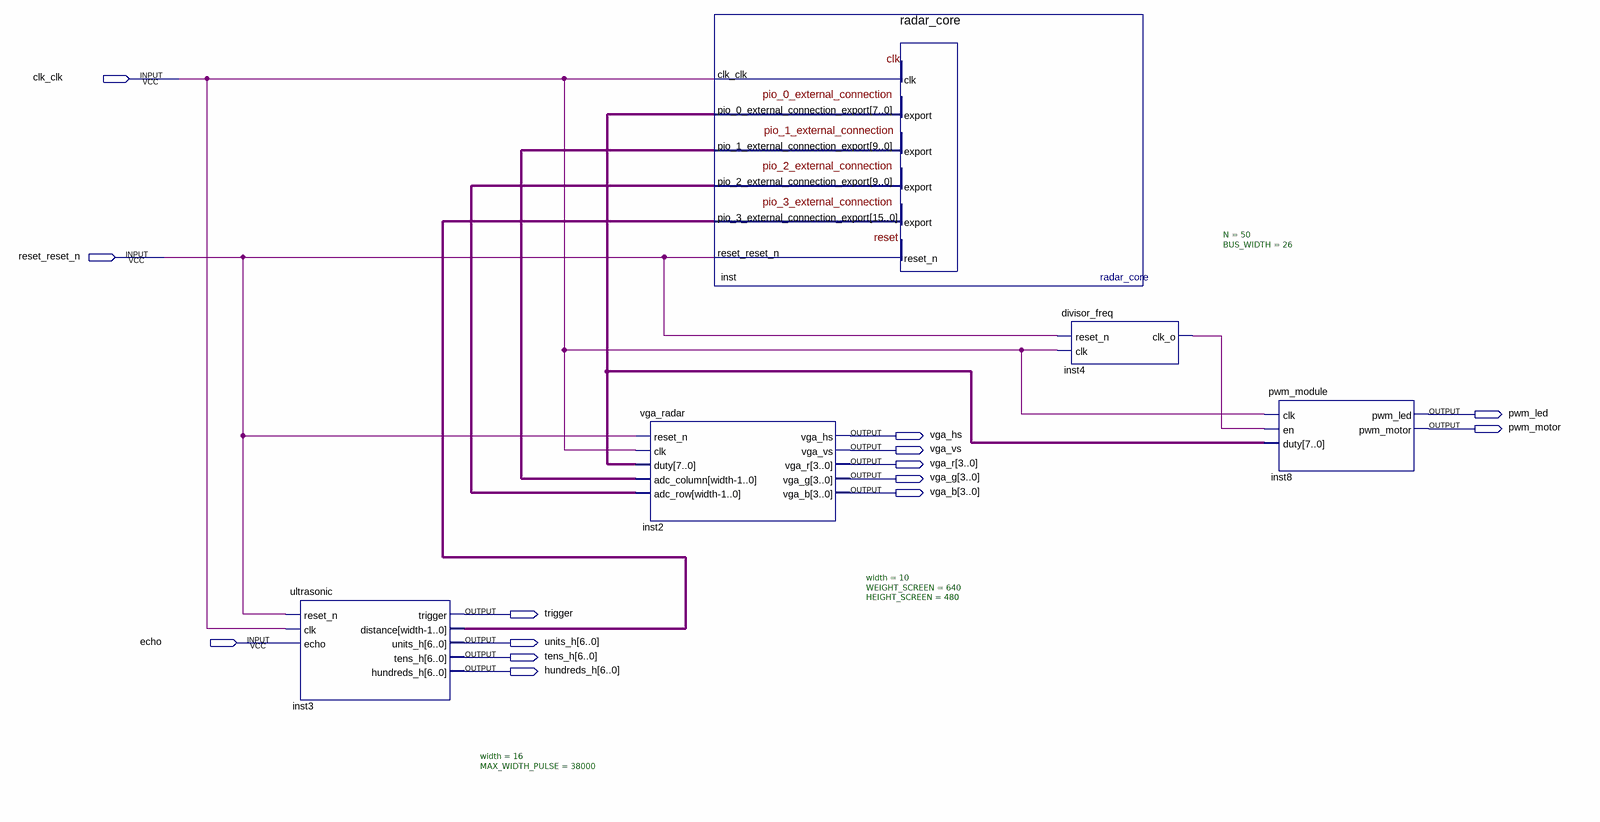
[diagram p0: schematic sheet]
// Quartus schematic radar_nios.bdf as structural Verilog: 5 symbols, 14 pins
module radar_nios (
  input  clk_clk,
  input  reset_reset_n,
  input  echo,
  output pwm_led,
  output pwm_motor,
  output vga_hs,
  output vga_vs,
  output [3:0] vga_r,
  output [3:0] vga_g,
  output [3:0] vga_b,
  output trigger,
  output [6:0] units_h,
  output [6:0] tens_h,
  output [6:0] hundreds_h
);

  wire inst4_clk_o;
  wire [7:0] inst_pio_0_external_connection_export;
  wire [9:0] inst_pio_1_external_connection_export, inst_pio_2_external_connection_export;
  wire [15:0] inst3_distance;

  ultrasonic #(.width(16), .MAX_WIDTH_PULSE(38000)) inst3 (
    .reset_n(reset_reset_n), .clk(clk_clk), .echo(echo), .trigger(trigger), .distance(inst3_distance),
    .units_h(units_h), .tens_h(tens_h), .hundreds_h(hundreds_h));
  vga_radar #(.width(10), .WEIGHT_SCREEN(640), .HEIGHT_SCREEN(480)) inst2 (
    .reset_n(reset_reset_n), .clk(clk_clk), .duty(inst_pio_0_external_connection_export),
    .adc_column(inst_pio_1_external_connection_export), .adc_row(inst_pio_2_external_connection_export),
    .vga_hs(vga_hs), .vga_vs(vga_vs), .vga_r(vga_r), .vga_g(vga_g), .vga_b(vga_b));
  radar_core inst (
    .clk_clk(clk_clk), .pio_3_external_connection_export(inst3_distance), .reset_reset_n(reset_reset_n),
    .pio_0_external_connection_export(inst_pio_0_external_connection_export),
    .pio_1_external_connection_export(inst_pio_1_external_connection_export),
    .pio_2_external_connection_export(inst_pio_2_external_connection_export));
  divisor_freq #(.N(50), .BUS_WIDTH(26)) inst4 (.reset_n(reset_reset_n), .clk(clk_clk), .clk_o(inst4_clk_o));
  pwm_module inst8 (
    .clk(clk_clk), .en(inst4_clk_o), .duty(inst_pio_0_external_connection_export), .pwm_led(pwm_led),
    .pwm_motor(pwm_motor));
endmodule
